# Altium schematic sheet mpiv2.SchDoc: mpiv2
size 282 x 200 mm; Date: 02/11/2018 16:38:43; SheetNumber: 1
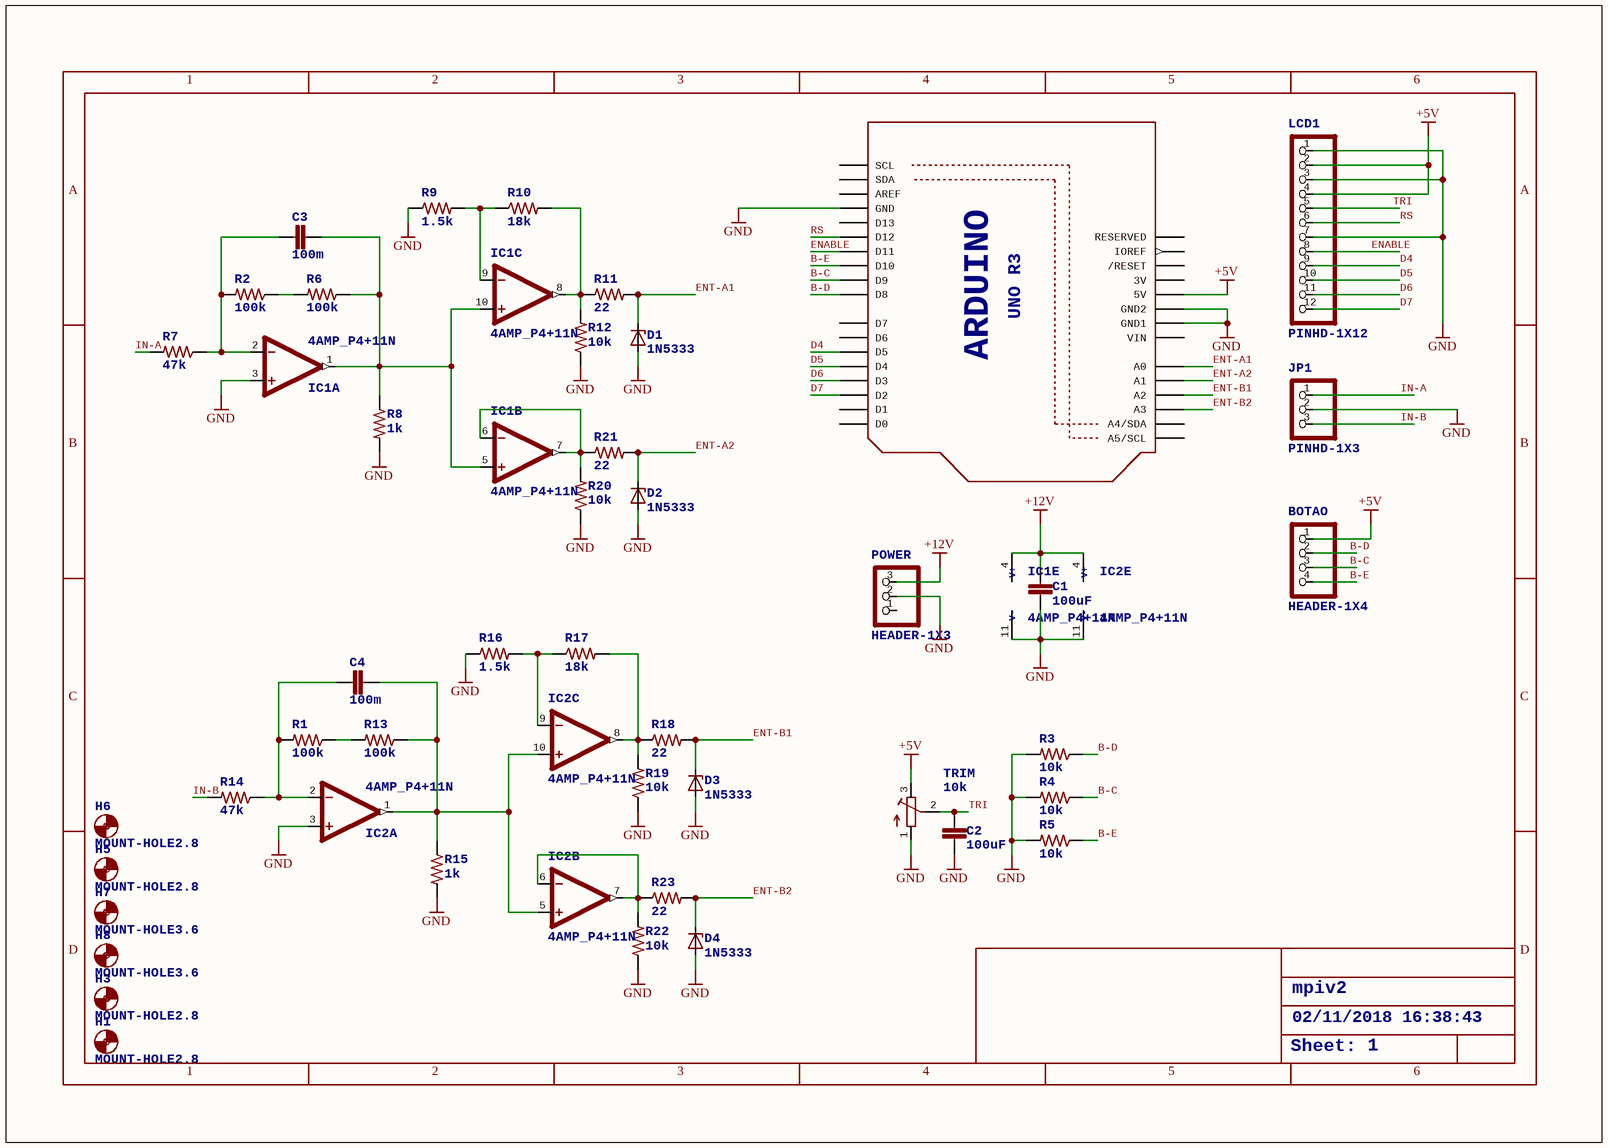
[diagram p0: mpiv2.SchDoc]

## Parts
BOTAO  HEADER-1X4  [1X04_OVAL]
C1  100uF  [C050-035X075]
C2  100uF  [C050-035X075]
C3  100m  [C075-032X103]
C4  100m  [C075-032X103]
D1  1N5333  [C1702-15]
D2  1N5333  [C1702-15]
D3  1N5333  [C1702-15]
D4  1N5333  [C1702-15]
H1  MOUNT-HOLE2.8  [2,8]
H3  MOUNT-HOLE2.8  [2,8]
H5  MOUNT-HOLE2.8  [2,8]
H6  MOUNT-HOLE2.8  [2,8]
H7  MOUNT-HOLE3.6  [3,6]
H8  MOUNT-HOLE3.6  [3,6]
IC1  4AMP_P4+11N  [DIL14]  (parts A,B,C,E of 5)
IC2  4AMP_P4+11N  [DIL14]  (parts A,B,C,E of 5)
JP1  PINHD-1X3  [1X03]
LCD1  PINHD-1X12  [1X12]
POWER  HEADER-1X3  [1X03_OVAL]
R1  100k  [0207/10]
R2  100k  [0207/10]
R3  10k  [0207/10]
R4  10k  [0207/10]
R5  10k  [0207/10]
R6  100k  [0207/10]
R7  47k  [0207/10]
R8  1k  [0207/10]
R9  1.5k  [0207/10]
R10  18k  [0207/10]
R11  22  [0207/10]
R12  10k  [0207/10]
R13  100k  [0207/10]
R14  47k  [0207/10]
R15  1k  [0207/10]
R16  1.5k  [0207/10]
R17  18k  [0207/10]
R18  22  [0207/10]
R19  10k  [0207/10]
R20  10k  [0207/10]
R21  22  [0207/10]
R22  10k  [0207/10]
R23  22  [0207/10]
TRIM  10k  [RTRIM74W]
U1  UNOR3: UNO R3  [ARDUINOR3-BPLACE]  (hidden comment: ARDUINOR3-BPLACE)

## Nets
+5V: BOTAO.1 LCD1.2 LCD1.4 TRIM.3(A) U1.5V
+12V: C1.1 IC1.4(V+) IC2.4(V+) POWER.3
GND: C1.2 C2.2 D1.A D2.A D3.A D4.A IC1.3(+IN) IC1.11(V-) IC2.3(+IN) IC2.11(V-) JP1.2 LCD1.1 LCD1.3 LCD1.7 POWER.2 R3.2 R4.2 R5.2 R8.2 R9.1 R12.1 R15.2 R16.1 R19.1 R20.1 R22.1 TRIM.1(E) U1.GND U1.GND1 U1.GND2
B-C: BOTAO.3 R4.1 U1.D9
B-D: BOTAO.2 R3.1 U1.D8
B-E: BOTAO.4 R5.1 U1.D10
D4: LCD1.9 U1.D5
D5: LCD1.10 U1.D4
D6: LCD1.11 U1.D3
D7: LCD1.12 U1.D2
ENABLE: LCD1.8 U1.D11
ENT-A1: D1.C R11.2 U1.A0
ENT-A2: D2.C R21.2 U1.A1
ENT-B1: D3.C R18.2 U1.A2
ENT-B2: D4.C R23.2 U1.A3
IN-A: JP1.1 R7.2
IN-B: JP1.3 R14.2
RS: LCD1.6 U1.D12
TRI: C2.1 LCD1.5 TRIM.2(S)
NetC3_1: C3.1 IC1.2(-IN) R2.2 R7.1
NetC3_2: C3.2 IC1.1(OUT) IC1.5(+IN) IC1.10(+IN) R6.1 R8.1
NetC4_1: C4.1 IC2.2(-IN) R1.2 R14.1
NetC4_2: C4.2 IC2.1(OUT) IC2.5(+IN) IC2.10(+IN) R13.1 R15.1
NetIC1_6: IC1.6(-IN) IC1.7(OUT) R20.2 R21.1
NetIC1_8: IC1.8(OUT) R10.2 R11.1 R12.2
NetIC1_9: IC1.9(-IN) R9.2 R10.1
NetIC2_6: IC2.6(-IN) IC2.7(OUT) R22.2 R23.1
NetIC2_8: IC2.8(OUT) R17.2 R18.1 R19.2
NetIC2_9: IC2.9(-IN) R16.2 R17.1
NetR1_1: R1.1 R13.2
NetR2_1: R2.1 R6.2

Not connected (* = marked no-connect by the designer): POWER 1; U1 3V A4(A4/SDA) A5(A5/SCL) AREF D0 D1 D6 D7 D13 IOREF RESERVED RESET(/RESET) SCL SDA VIN

## Notes on the sheet
- mpiv2
- 02/11/2018 16:38:43
- Sheet:
- 1
- 2
- 3
- 4
- 5
- 6
- A
- B
- C
- D

## Library data of the parts
BOTAO = HEADER-1X4: PIN HEADER
C1 C2 = C-EU050-035X075: CAPACITOR, European symbol
C3 C4 = C-EU075-032X103: CAPACITOR, European symbol
D1-D4 = 1N5333: Z DIODE   3.3 V, 5W, 5 percent (Motorola)
H1 H3 H5 H6 = MOUNT-HOLE2.8: MOUNTING HOLE with drill center marker
H7 H8 = MOUNT-HOLE3.6: MOUNTING HOLE with drill center marker
IC1 IC2 = 4AMP_P4+11N: OP AMP
JP1 = PINHD-1X3: PIN HEADER
LCD1 = PINHD-1X12: PIN HEADER
POWER = HEADER-1X3: PIN HEADER
R1-R23 = R-US_0207/10: RESISTOR, American symbol
TRIM = R-TRIMM74W: Trimm resistor
U1 = ARDUINOR3-BPLACE: This is a new object for the new Arduino R3 - with extra pins that you may want to use (such as IOref, and duplicated A4/A5; ARDUINO: ARDUINO